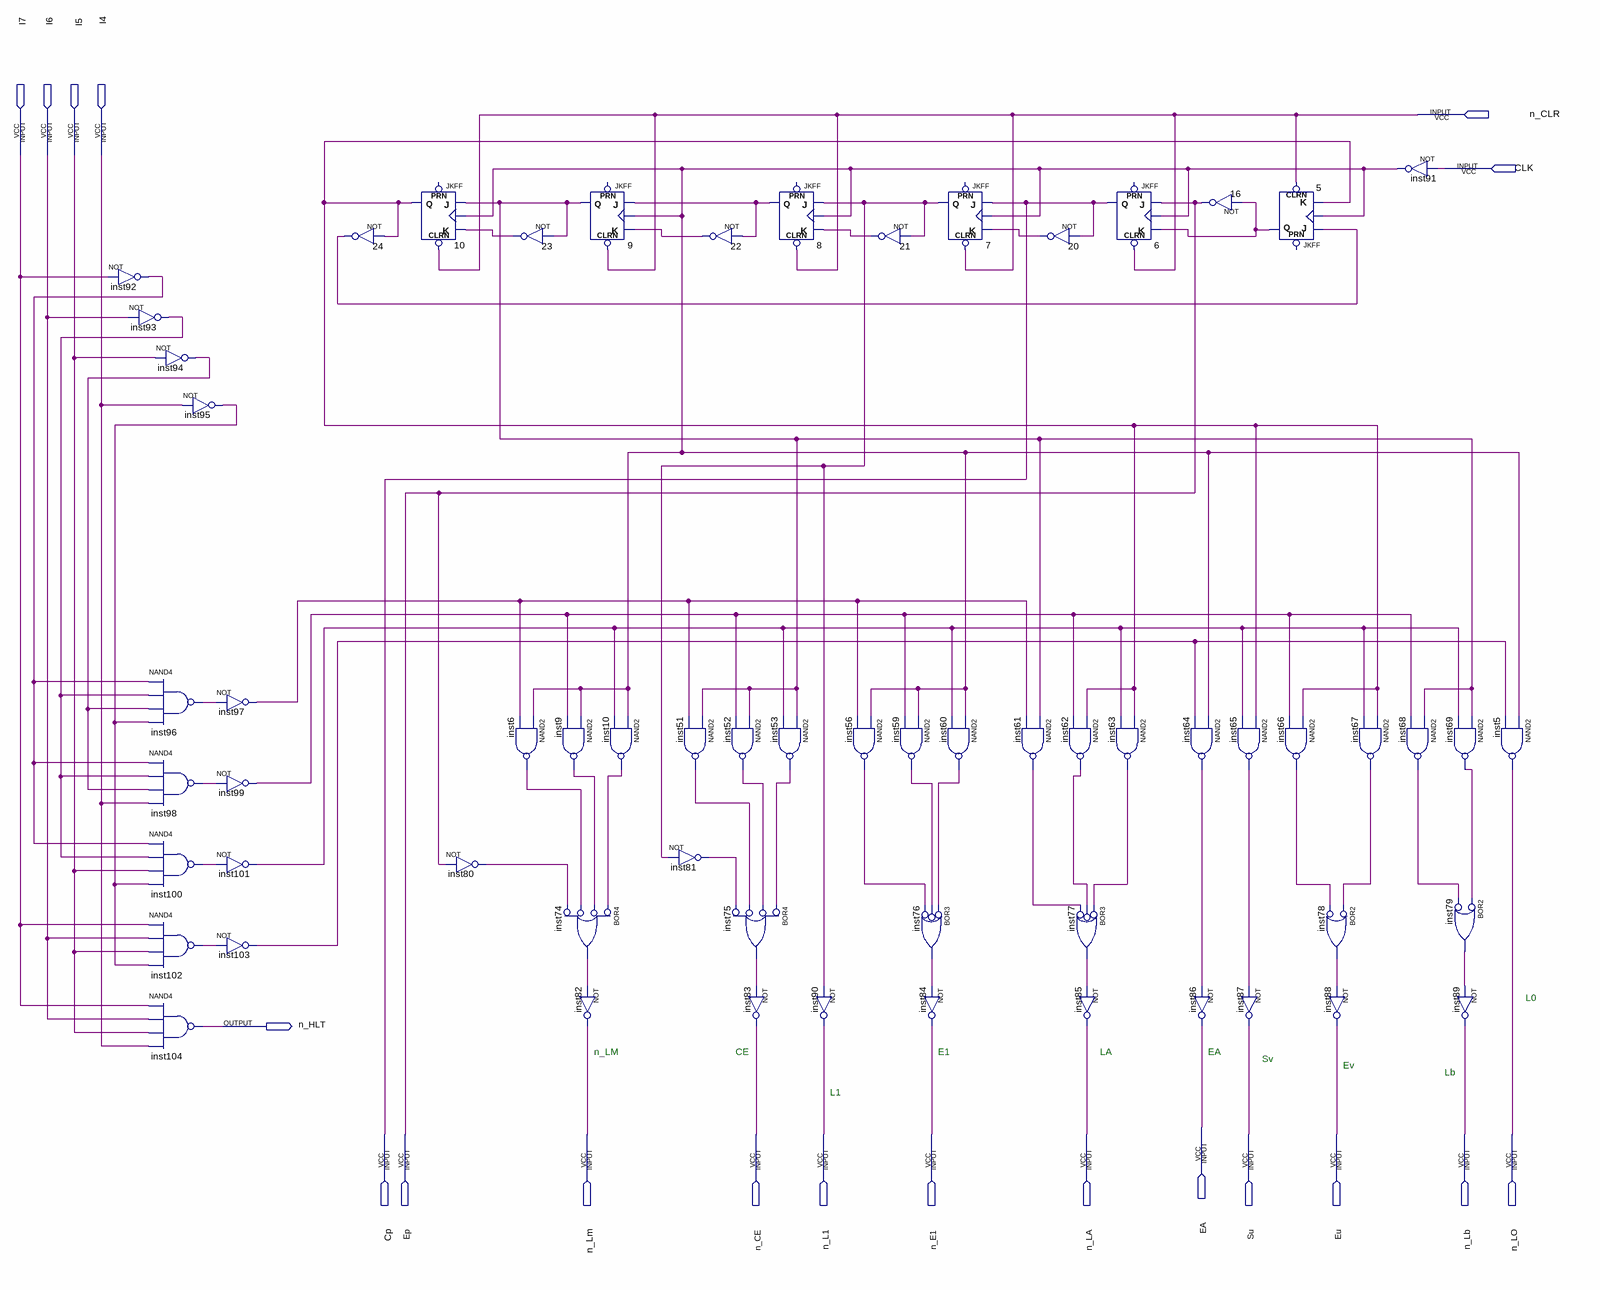
[diagram p0: schematic sheet]
// Quartus schematic CONTROLADOR.bdf as structural Verilog: 62 symbols, 19 pins
module CONTROLADOR (
  input  n_CLR,
  input  I7,
  input  I6,
  input  I5,
  input  I4,
  input  CLK,
  input  EA,
  input  Cp,
  input  Ep,
  input  n_Lm,
  input  n_CE,
  input  n_L1,
  input  n_E1,
  input  n_LA,
  input  Su,
  input  Eu,
  input  n_Lb,
  input  n_LO,
  output n_HLT
);

  wire inst6_out, inst9_out, inst10_out, inst51_out, inst52_out, inst53_out, inst56_out, inst59_out,
       inst60_out, inst61_out, inst62_out, inst63_out, inst64_out, inst65_out, inst66_out, inst67_out,
       inst68_out, inst69_out, inst74_out, inst75_out, inst76_out, inst77_out, inst78_out, inst79_out,
       inst80_out, inst81_out, inst91_out, inst92_out, inst93_out, inst94_out, inst95_out, inst96_out,
       inst97_out, inst98_out, inst99_out, inst100_out, inst101_out, inst102_out, inst103_out, n5_q, n7_q,
       n8_q, n9_q, n10_q, n20_out, n21_out, n22_out, n23_out, n24_out;

  not inst92 (inst92_out, I7);
  not inst93 (inst93_out, I6);
  not inst94 (inst94_out, I5);
  nand inst96 (inst96_out, inst92_out, inst93_out, inst94_out, inst95_out);
  nand inst98 (inst98_out, inst92_out, inst93_out, inst94_out, I4);
  nand inst100 (inst100_out, inst92_out, inst93_out, I5, inst95_out);
  nand inst102 (inst102_out, I7, I6, I5, inst95_out);
  nand inst104 (n_HLT, I7, I6, I5, I4);
  not inst95 (inst95_out, I4);
  not inst97 (inst97_out, inst96_out);
  not inst99 (inst99_out, inst98_out);
  not inst101 (inst101_out, inst100_out);
  not inst103 (inst103_out, inst102_out);
  not u_24 (n24_out, n10_q);
  JKFF u_10 (.CLRN(n_CLR), .K(n23_out), .J(n9_q), .CLK(inst91_out), .Q(n10_q));  // open: PRN
  not inst80 (inst80_out, Ep);
  not u_23 (n23_out, n9_q);
  nand inst6 (inst6_out, inst91_out, inst97_out);
  JKFF u_9 (.CLRN(n_CLR), .K(n22_out), .J(n8_q), .CLK(inst91_out), .Q(n9_q));  // open: PRN
  nand inst9 (inst9_out, inst91_out, inst99_out);
  nand inst10 (inst10_out, inst91_out, inst101_out);
  or inst74 (inst74_out, ~inst10_out, ~inst9_out, ~inst6_out, ~inst80_out);  // BOR4
  not inst82 (n_Lm, inst74_out);
  not u_22 (n22_out, n8_q);
  nand inst51 (inst51_out, n9_q, inst97_out);
  not inst81 (inst81_out, n7_q);
  nand inst52 (inst52_out, n9_q, inst99_out);
  or inst75 (inst75_out, ~inst53_out, ~inst52_out, ~inst51_out, ~inst81_out);  // BOR4
  not inst83 (n_CE, inst75_out);
  JKFF u_8 (.CLRN(n_CLR), .K(n21_out), .J(n7_q), .CLK(inst91_out), .Q(n8_q));  // open: PRN
  nand inst53 (inst53_out, n9_q, inst101_out);
  not inst90 (n_L1, n7_q);
  not u_21 (n21_out, n7_q);
  nand inst56 (inst56_out, inst91_out, inst97_out);
  nand inst59 (inst59_out, inst91_out, inst99_out);
  or inst76 (inst76_out, ~inst60_out, ~inst59_out, ~inst56_out);  // BOR3
  not inst84 (n_E1, inst76_out);
  JKFF u_7 (.CLRN(n_CLR), .K(n20_out), .J(Cp), .CLK(inst91_out), .Q(n7_q));  // open: PRN
  nand inst60 (inst60_out, inst91_out, inst101_out);
  nand inst61 (inst61_out, n9_q, inst97_out);
  not u_20 (n20_out, Cp);
  nand inst62 (inst62_out, n10_q, inst99_out);
  or inst77 (inst77_out, ~inst63_out, ~inst62_out, ~inst61_out);  // BOR3
  not inst85 (n_LA, inst77_out);
  JKFF u_6 (.CLRN(n_CLR), .K(n5_q), .J(Ep), .CLK(inst91_out), .Q(Cp));  // open: PRN
  nand inst63 (inst63_out, n10_q, inst101_out);
  nand inst64 (inst64_out, inst91_out, inst103_out);
  not inst86 (EA, inst64_out);
  not u_16 (Ep, n5_q);
  nand inst65 (inst65_out, n10_q, inst101_out);
  not inst87 (Su, inst65_out);
  JKFF u_5 (.CLRN(n_CLR), .K(n10_q), .J(n24_out), .CLK(inst91_out), .Q(n5_q));  // open: PRN
  nand inst66 (inst66_out, n10_q, inst99_out);
  nand inst67 (inst67_out, n10_q, inst101_out);
  or inst78 (inst78_out, ~inst67_out, ~inst66_out);  // BOR2
  not inst88 (Eu, inst78_out);
  not inst91 (inst91_out, CLK);
  nand inst68 (inst68_out, n9_q, inst99_out);
  nand inst69 (inst69_out, n9_q, inst101_out);
  or inst79 (inst79_out, ~inst69_out, ~inst68_out);  // BOR2
  not inst89 (n_Lb, inst79_out);
  nand inst5 (n_LO, inst91_out, inst103_out);

  // Notes on the sheet:
  //   L0
  //   n_LM
  //   CE
  //   E1
  //   LA
  //   EA
  //   Sv
  //   Ev
  //   Lb
  //   L1
endmodule
